# EasyEDA Pro project ORCA_Power Bus.epro

# Schematic ORCA

## Sheets
1 ORCA Power Circuit: Board Name: ORCA; Create Date: 2025-01-24; Page Name: ORCA Power Circuit; Project Name: ORCA_Pro; Schematic Name: ORCA; Update Date: 2025-01-24; Add into BOM: yes; Company: Synerbotics; Convert to PCB: yes; Date: 2025-01-23; Draw By: Nainaiu Rakhaine; REV: 1.0; Sheet: 1/1
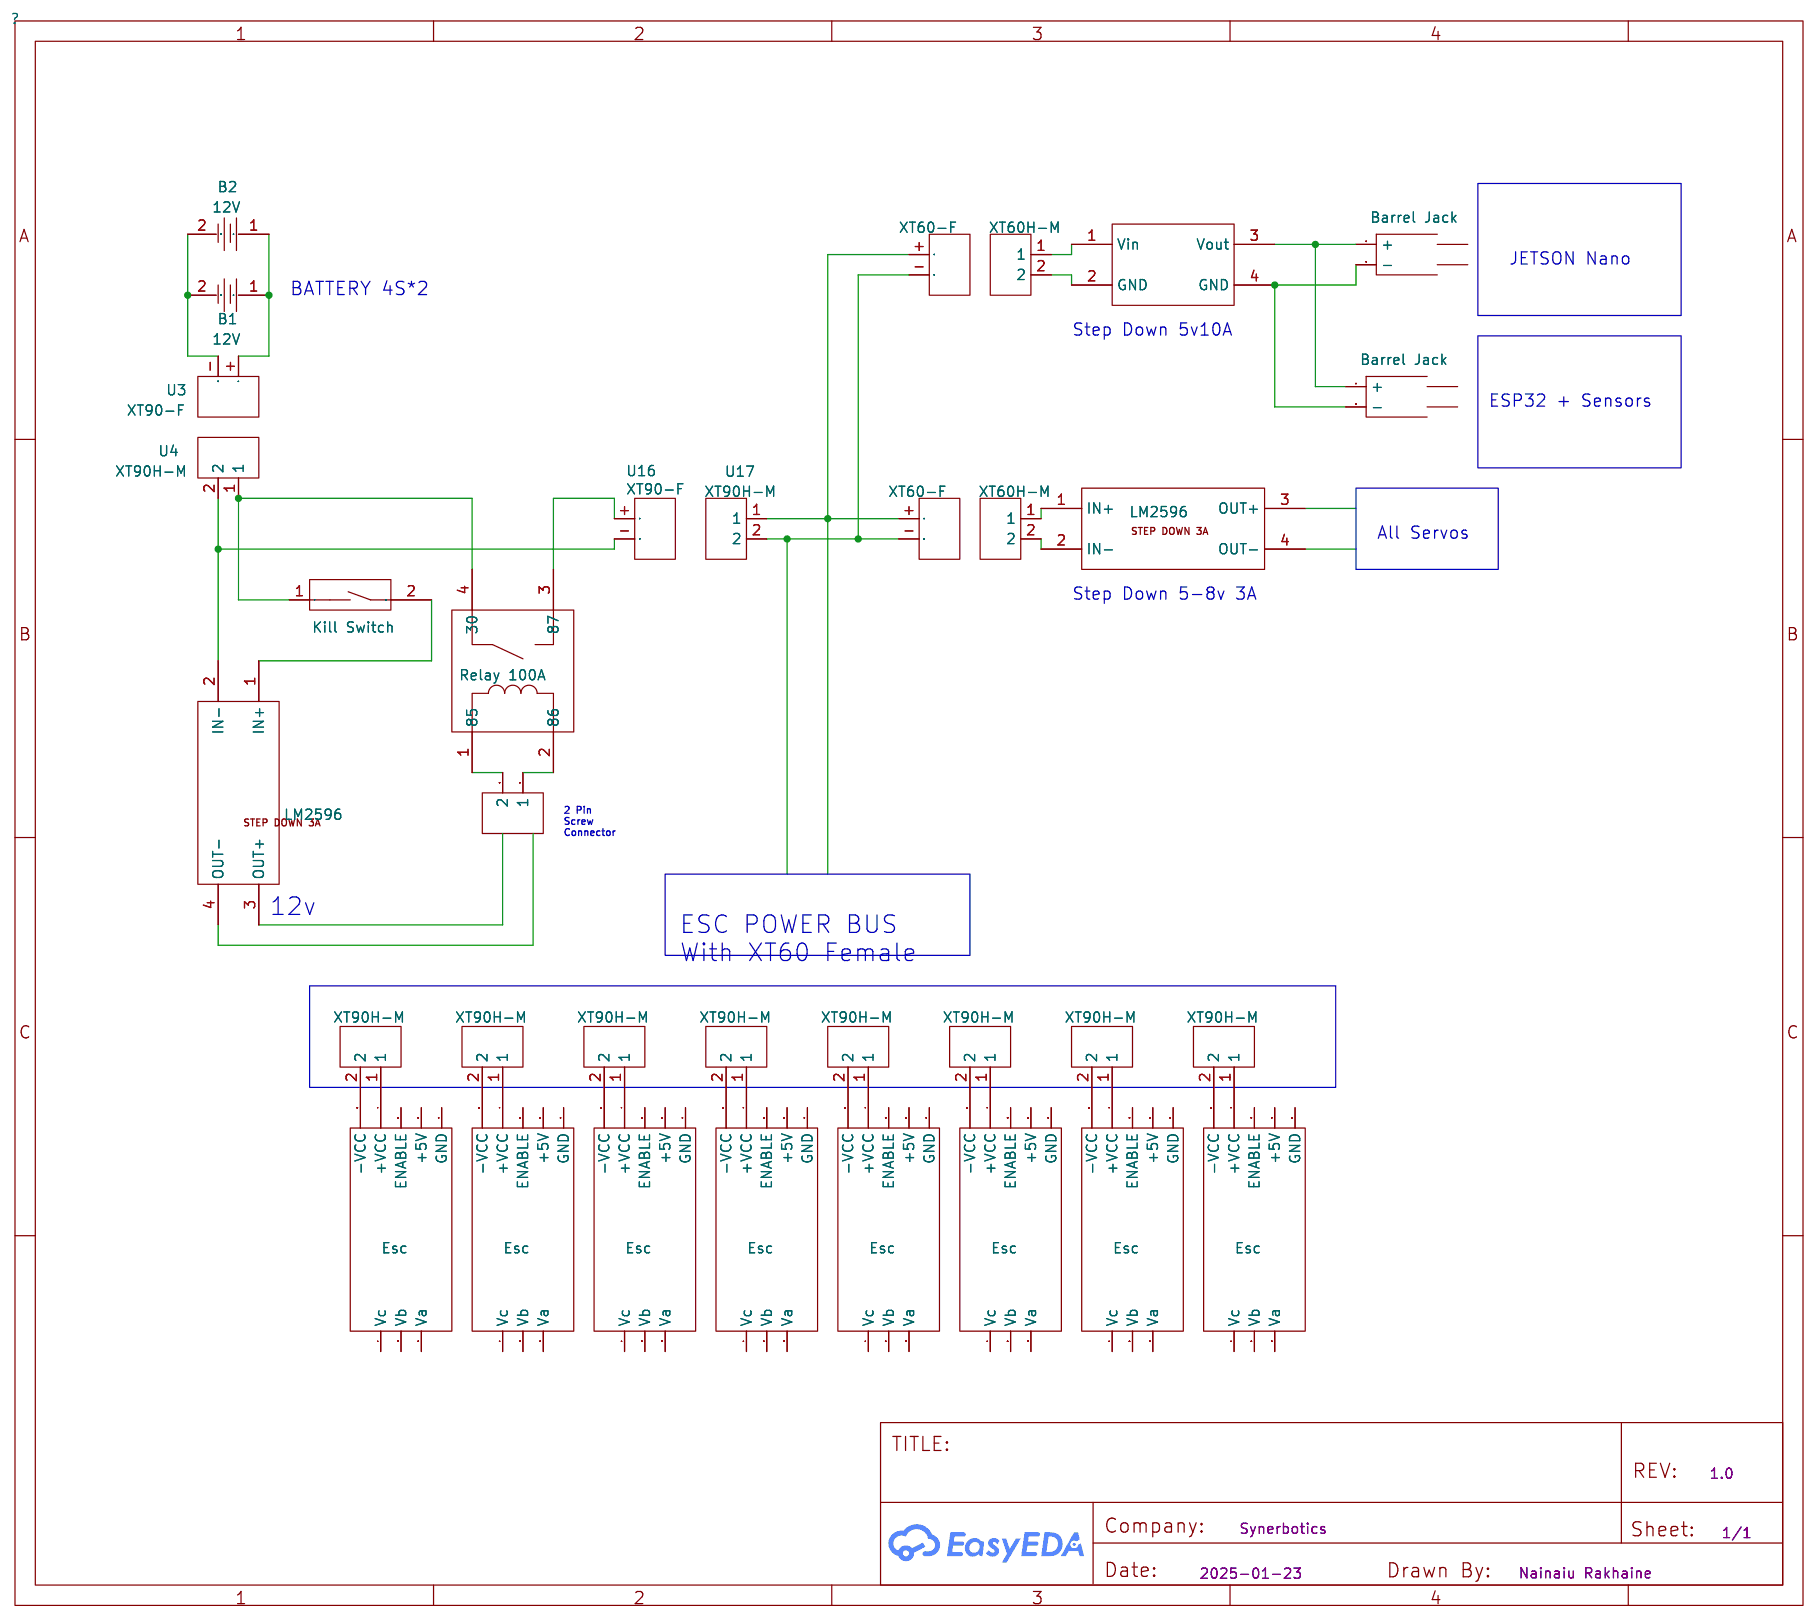
[diagram p0: ORCA Power Circuit]
2 Sheet_1
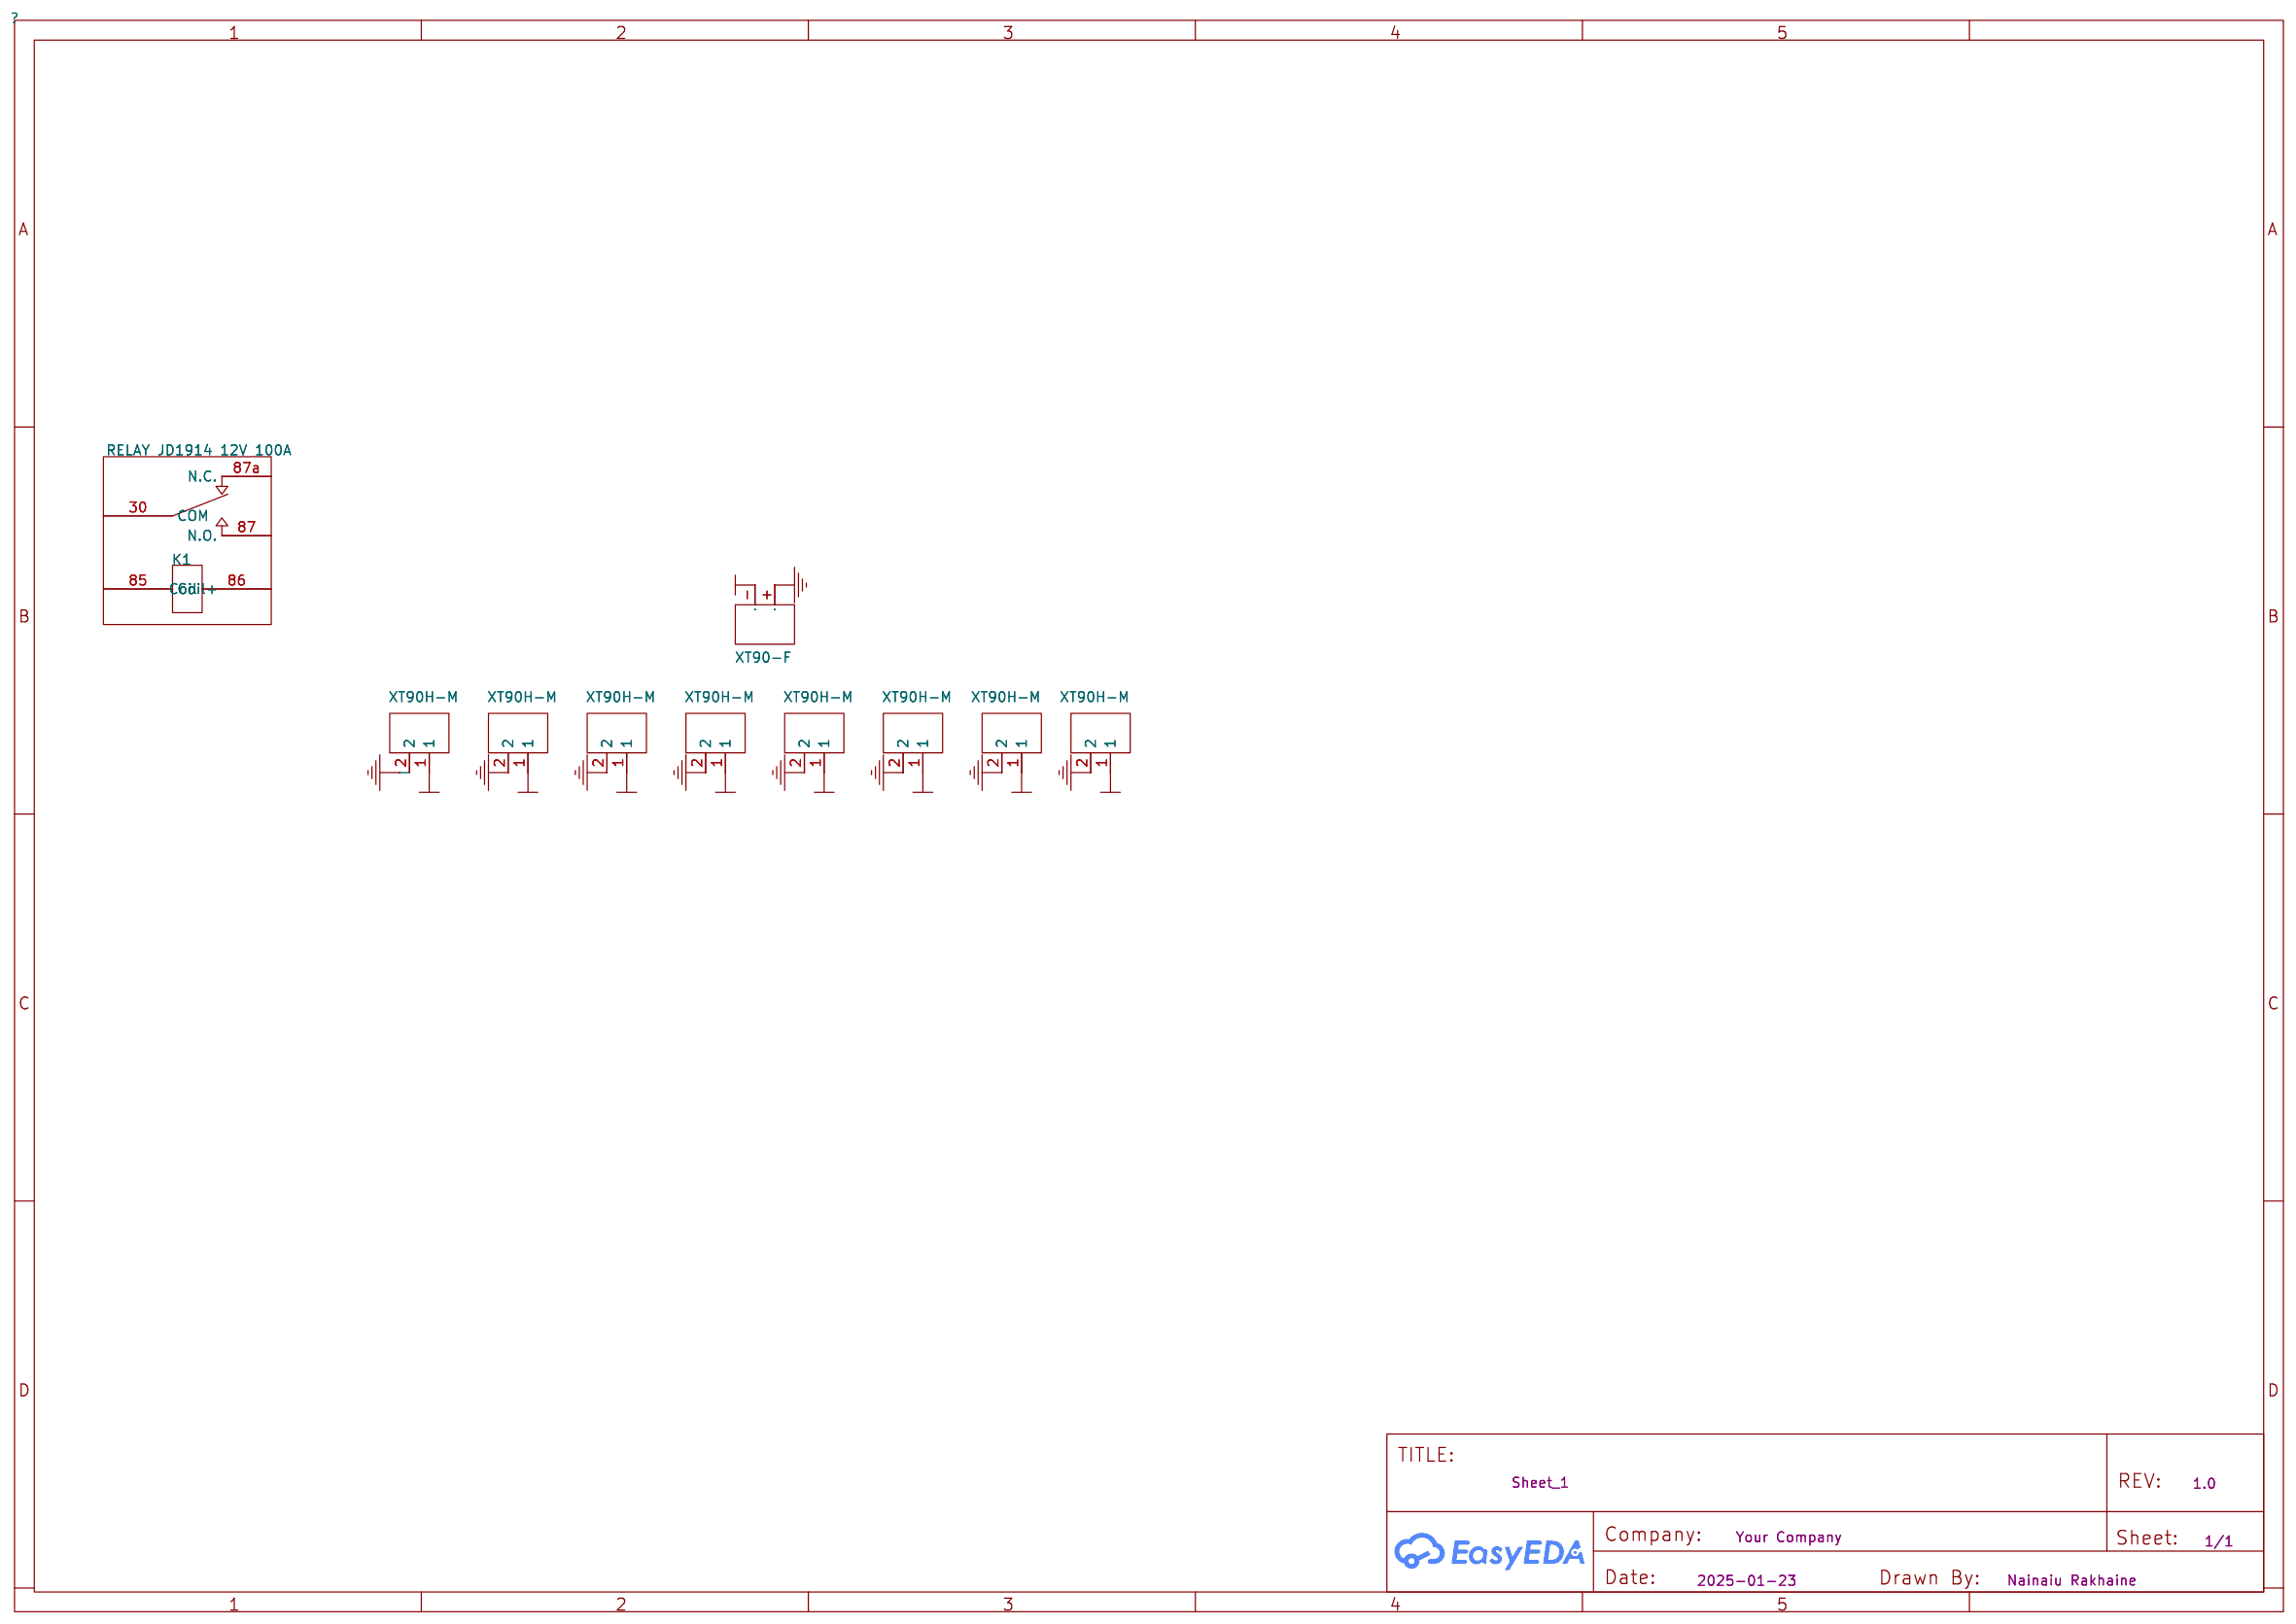
[diagram p1: Sheet_1]

## Parts
sheet ORCA Power Circuit
2  2 PIN TERMINAL BLOCK 5.08 MM
B1  12V
B2  12V
DIP1  Kill Switch
U1  Esc
U2  Relay 100A
U3  XT90-F
U4  XT90H-M
U5  XT60-F
U6  Step Down10A
U7  LM2596
U8  Barrel Jack
U9  Esc
U10  Esc
U11  Esc
U12  Esc
U13  Esc
U14  Esc
U15  Esc
U16  XT90-F
U17  XT90H-M
U18  XT90H-M
U19  XT90H-M
U20  XT90H-M
U21  XT90H-M
U22  XT90H-M
U23  XT90H-M
U24  XT90H-M
U25  XT90H-M
U26  XT60-F
U27  XT60H-M
U28  XT60H-M
U29  LM2596
U30  Barrel Jack
sheet Sheet_1
K1  RELAY JD1914 12V 100A  [JD1914]
U31  XT90-F
U32  XT90H-M
U33  XT90H-M
U34  XT90H-M
U35  XT90H-M
U36  XT90H-M
U37  XT90H-M
U38  XT90H-M
U39  XT90H-M

## Library data of the parts
2 = 2 PIN TERMINAL BLOCK 5.08 MM: Supplier: Master; Manufacturer: Unknown; Manufacturer Part: Screw Terminal Block: 2-Pin; image: https://ae01.alicdn.com/kf/HTB1jBRhXnHuK1RkSndVq6xVwpXae.jpg; Supplier Part: Unknown
B1 B2 = 12V: Supplier: LCSC; Manufacturer: Q&J; Manufacturer Part: BS-2-1; image: http://image.lceda.cn/szlcsc/C70376.jpg; Supplier Part: C70376
DIP1 = Kill Switch: Manufacturer: DIP; Manufacturer Part: DIP switchEI-08; Supplier Part: C90019; libConvert: Yes
U1 U9-U15 = Esc: Supplier: LCSC; Supplier Part: C920582; Manufacturer: PowerGood; Manufacturer Part: ESCS024W150-S-P-F50EC; JLCPCB Part Class: Extended Part
U2 = Relay 100A: Supplier: LCSC; Supplier Part: C9900017464; Manufacturer: null; Manufacturer Part: JD2912-1H-12VDC; JLCPCB Part Class: Extended Part
U3 U16 U31 = XT90-F: Supplier: LCSC; Supplier Part: C98734; Manufacturer: AMASS(艾迈斯); Manufacturer Part: XT60-F; JLCPCB Part Class: Extended Part
U4 U17-U25 U32-U39 = XT90H-M: Supplier: LCSC; Supplier Part: C5334533; Manufacturer: AMASS(艾迈斯); Manufacturer Part: XT60H-M; JLCPCB Part Class: Extended Part
U5 U26 = XT60-F: Supplier: LCSC; Supplier Part: C98734; Manufacturer: AMASS(艾迈斯); JLCPCB Part Class: Extended Part
U6 = Step Down10A
U7 U29 = LM2596: Manufacturer: PEJ; Manufacturer Part: STEP DOWN 3A; Supplier: PEJ
U8 U30 = Barrel Jack
U27 U28 = XT60H-M: Supplier: LCSC; Supplier Part: C5334533; Manufacturer: AMASS(艾迈斯); JLCPCB Part Class: Extended Part
K1 = RELAY JD1914 12V 100A: Manufacturer: BenFeng; Supplier: Aliexpress; link: http://www.msrelay.com/Auto_Relay/118.html

## Nets
GND: U31.+(1) U32.2 U33.2 U34.2 U35.2 U36.2 U37.2 U38.2 U39.2
VCC: U31.-(2) U32.1 U33.1 U34.1 U35.1 U36.1 U37.1 U38.1 U39.1
Net-(2-1): 2.1 U2.2(86)
Net-(2-2): 2.2 U2.1(85)
Net-(B1-1): B1.1 B2.1 U3.+(1)
Net-(B1-2): B1.2 B2.2 U3.-(2)
Net-(DIP1-1): DIP1.1 U2.4(30) U4.1
Net-(DIP1-2): DIP1.2 U7.1(IN+)
Net-(U1-7): U1.7(+VCC) U18.1
Net-(U1-8): U1.8(-VCC) U18.2
Net-(U2-3): U2.3(87) U16.+(1)
Net-(U4-2): U4.2 U7.2(IN-) U16.-(2)
Net-(U5-+): U5.+(1) U17.1 U26.+(1)
Net-(U5--): U5.-(2) U17.2 U26.-(2)
Net-(U6-1): U6.1(Vin) U27.1
Net-(U6-2): U6.2(GND) U27.2
Net-(U6-3): U6.3(Vout) U8.1(+) U30.1(+)
Net-(U6-4): U6.4(GND) U8.2(-) U30.2(-)
Net-(U9-7): U9.7(+VCC) U19.1
Net-(U9-8): U9.8(-VCC) U19.2
Net-(U10-7): U10.7(+VCC) U20.1
Net-(U10-8): U10.8(-VCC) U20.2
Net-(U11-7): U11.7(+VCC) U23.1
Net-(U11-8): U11.8(-VCC) U23.2
Net-(U12-7): U12.7(+VCC) U22.1
Net-(U12-8): U12.8(-VCC) U22.2
Net-(U13-7): U13.7(+VCC) U21.1
Net-(U13-8): U13.8(-VCC) U21.2
Net-(U14-7): U14.7(+VCC) U25.1
Net-(U14-8): U14.8(-VCC) U25.2
Net-(U15-7): U15.7(+VCC) U24.1
Net-(U15-8): U15.8(-VCC) U24.2
Net-(U28-1): U28.1 U29.1(IN+)
Net-(U28-2): U28.2 U29.2(IN-)

Not connected (* = marked no-connect by the designer): K1 30(COM) 85(Coil+) 86(Coil) 87(N.O.) 87a(N.C.); U1 1(GND) 2(+5V) 3(ENABLE) 4(Vc) 5(Vb) 6(Va); U7 3(OUT+) 4(OUT-); U9 1(GND) 2(+5V) 3(ENABLE) 4(Vc) 5(Vb) 6(Va); U10 1(GND) 2(+5V) 3(ENABLE) 4(Vc) 5(Vb) 6(Va); U11 1(GND) 2(+5V) 3(ENABLE) 4(Vc) 5(Vb) 6(Va); U12 1(GND) 2(+5V) 3(ENABLE) 4(Vc) 5(Vb) 6(Va); U13 1(GND) 2(+5V) 3(ENABLE) 4(Vc) 5(Vb) 6(Va); U14 1(GND) 2(+5V) 3(ENABLE) 4(Vc) 5(Vb) 6(Va); U15 1(GND) 2(+5V) 3(ENABLE) 4(Vc) 5(Vb) 6(Va); U29 3(OUT+) 4(OUT-)

## Notes on the sheets
sheet 1
- JETSON Nano
- BATTERY 4S*2
- Step Down 5v10A
- ESP32 + Sensors
- All Servos
- Step Down 5-8v 3A
- 2 Pin
  Screw
  Connector
- 12v
- ESC POWER BUS
  With XT60 Female

# Board ESC Power BUS
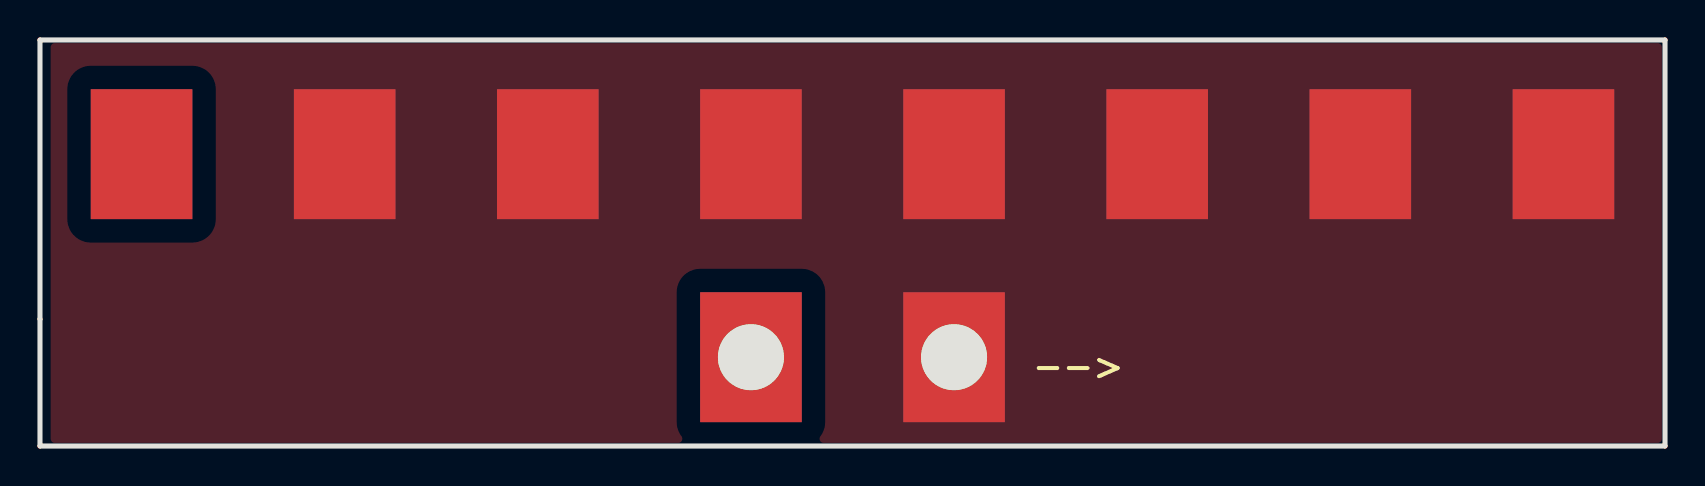
[diagram p2: board, top side]
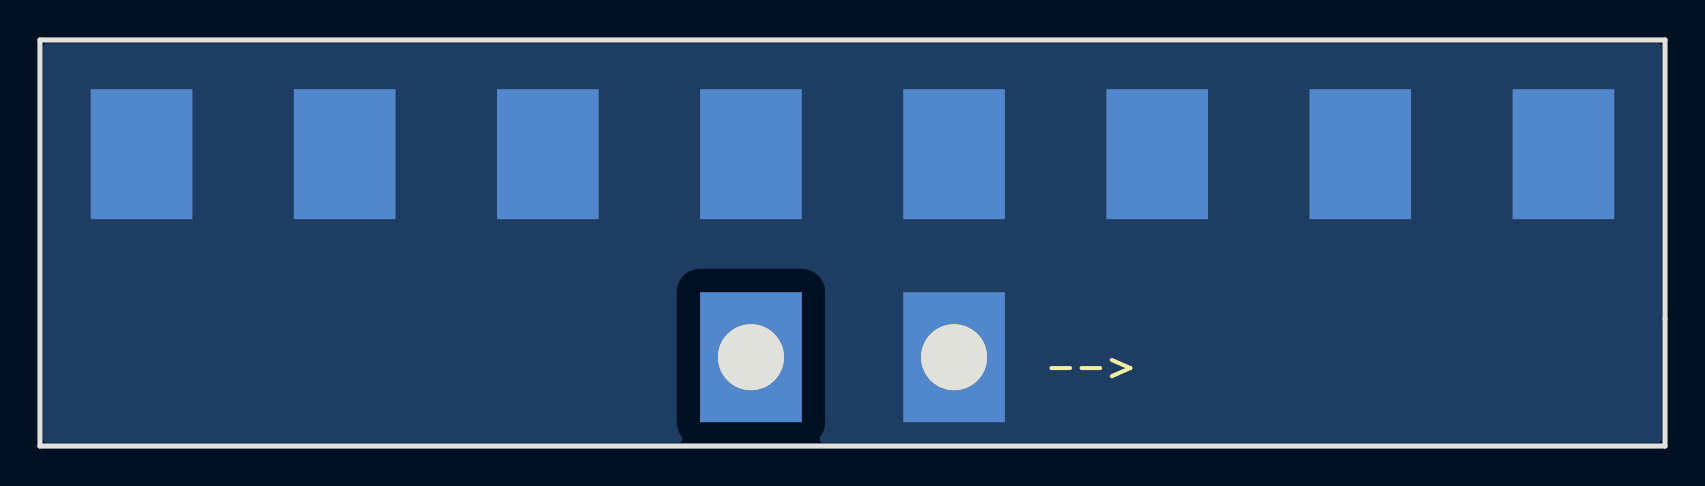
[diagram p3: board, bottom side, seen from below]

Outline 81.28 x 20.32 mm; copper layers: Top Layer, Bottom Layer. Coordinates in mm from the lower left corner of the outline.
Outline path: 0,20.32 81.28,20.32 81.28,0 0,0 0,20.32

## Design rules (mm)
spacing Default (default): track to track 0.152, other pairs 0 to 0.152
track width Default (default): min 0.254, default 0.254, max 25.4
via Default (default): diameter min 0.61, default 0.61, max 100.025; hole min 0.305, default 0.305, max 59.995
pour e14 uses gge1079
pour e24 uses gge1091

## Placement (name value [footprint] x y rotation side)
NOREF  -  [Pad_e16]  76.2 14.6 180 top
NOREF#2  -  [Pad_e18]  55.88 14.6 180 top
NOREF#3  -  [Pad_e23]  5.08 14.6 180 top
NOREF#4  -  [Pad_e10]  66.04 14.6 180 top
NOREF#5  -  [Pad_e6]  5.08 14.6 180 top
NOREF#6  -  [Pad_e22]  15.24 14.6 180 top
NOREF#7  -  [Pad_e8]  25.4 14.6 180 top
NOREF#8  -  [Pad_e13]  35.56 14.6 180 top
NOREF#9  -  [Pad_e17]  66.04 14.6 180 top
NOREF#10  -  [Pad_e20]  35.56 14.6 180 top
NOREF#11  -  [Pad_e9]  76.2 14.6 180 top
NOREF#12  -  [Pad_e7]  15.24 14.6 180 top
NOREF#13  -  [Pad_e19]  45.72 14.6 180 top
NOREF#14  -  [Pad_e29]  45.72 4.44 180 top
NOREF#15  -  [Pad_e11]  55.88 14.6 180 top
NOREF#16  -  [Pad_e28]  35.56 4.44 180 top
NOREF#17  -  [Pad_e21]  25.4 14.6 180 top
NOREF#18  -  [Pad_e12]  45.72 14.6 180 top

## Footprints (pads in the part's own frame, mm; a bottom-side part is the same pattern mirrored in y, then rotated)
Pad_e6
  rect 5.08x6.5 smd: 1(0,0)
Pad_e7
  rect 5.08x6.5 smd: 1(0,0)
Pad_e8
  rect 5.08x6.5 smd: 1(0,0)
Pad_e9
  rect 5.08x6.5 smd: 1(0,0)
Pad_e10
  rect 5.08x6.5 smd: 1(0,0)
Pad_e11
  rect 5.08x6.5 smd: 1(0,0)
Pad_e12
  rect 5.08x6.5 smd: 1(0,0)
Pad_e13
  rect 5.08x6.5 smd: 1(0,0)
Pad_e16
  rect 5.08x6.5 smd far side: 1(0,0)
Pad_e17
  rect 5.08x6.5 smd far side: 1(0,0)
Pad_e18
  rect 5.08x6.5 smd far side: 1(0,0)
Pad_e19
  rect 5.08x6.5 smd far side: 1(0,0)
Pad_e20
  rect 5.08x6.5 smd far side: 1(0,0)
Pad_e21
  rect 5.08x6.5 smd far side: 1(0,0)
Pad_e22
  rect 5.08x6.5 smd far side: 1(0,0)
Pad_e23
  rect 5.08x6.5 smd far side: 1(0,0)
Pad_e28
  rect 5.08x6.5 hole 3.302: 1(0,0)
Pad_e29
  rect 5.08x6.5 hole 3.302: 1(0,0)

## Nets
GND: NOREF.1 NOREF#2.1 NOREF#3.1 NOREF#5.1 NOREF#6.1 NOREF#9.1 NOREF#10.1 NOREF#13.1 NOREF#16.1 NOREF#17.1
V+: NOREF#4.1 NOREF#7.1 NOREF#8.1 NOREF#11.1 NOREF#12.1 NOREF#14.1 NOREF#15.1 NOREF#18.1

## Copper pours and planes (outline as drawn; the poured copper is in the pictures)
GND on Bottom Layer: -0.64,20.95 82.55,20.95 82.55,-1.27 -0.64,-1.27
V+ on Top Layer: 0.63,20.32 81.92,20.32 81.92,0 0.63,0

## Text on the board
Bottom Silkscreen Layer: -->
Top Silkscreen Layer: -->

# Board Power Circuit
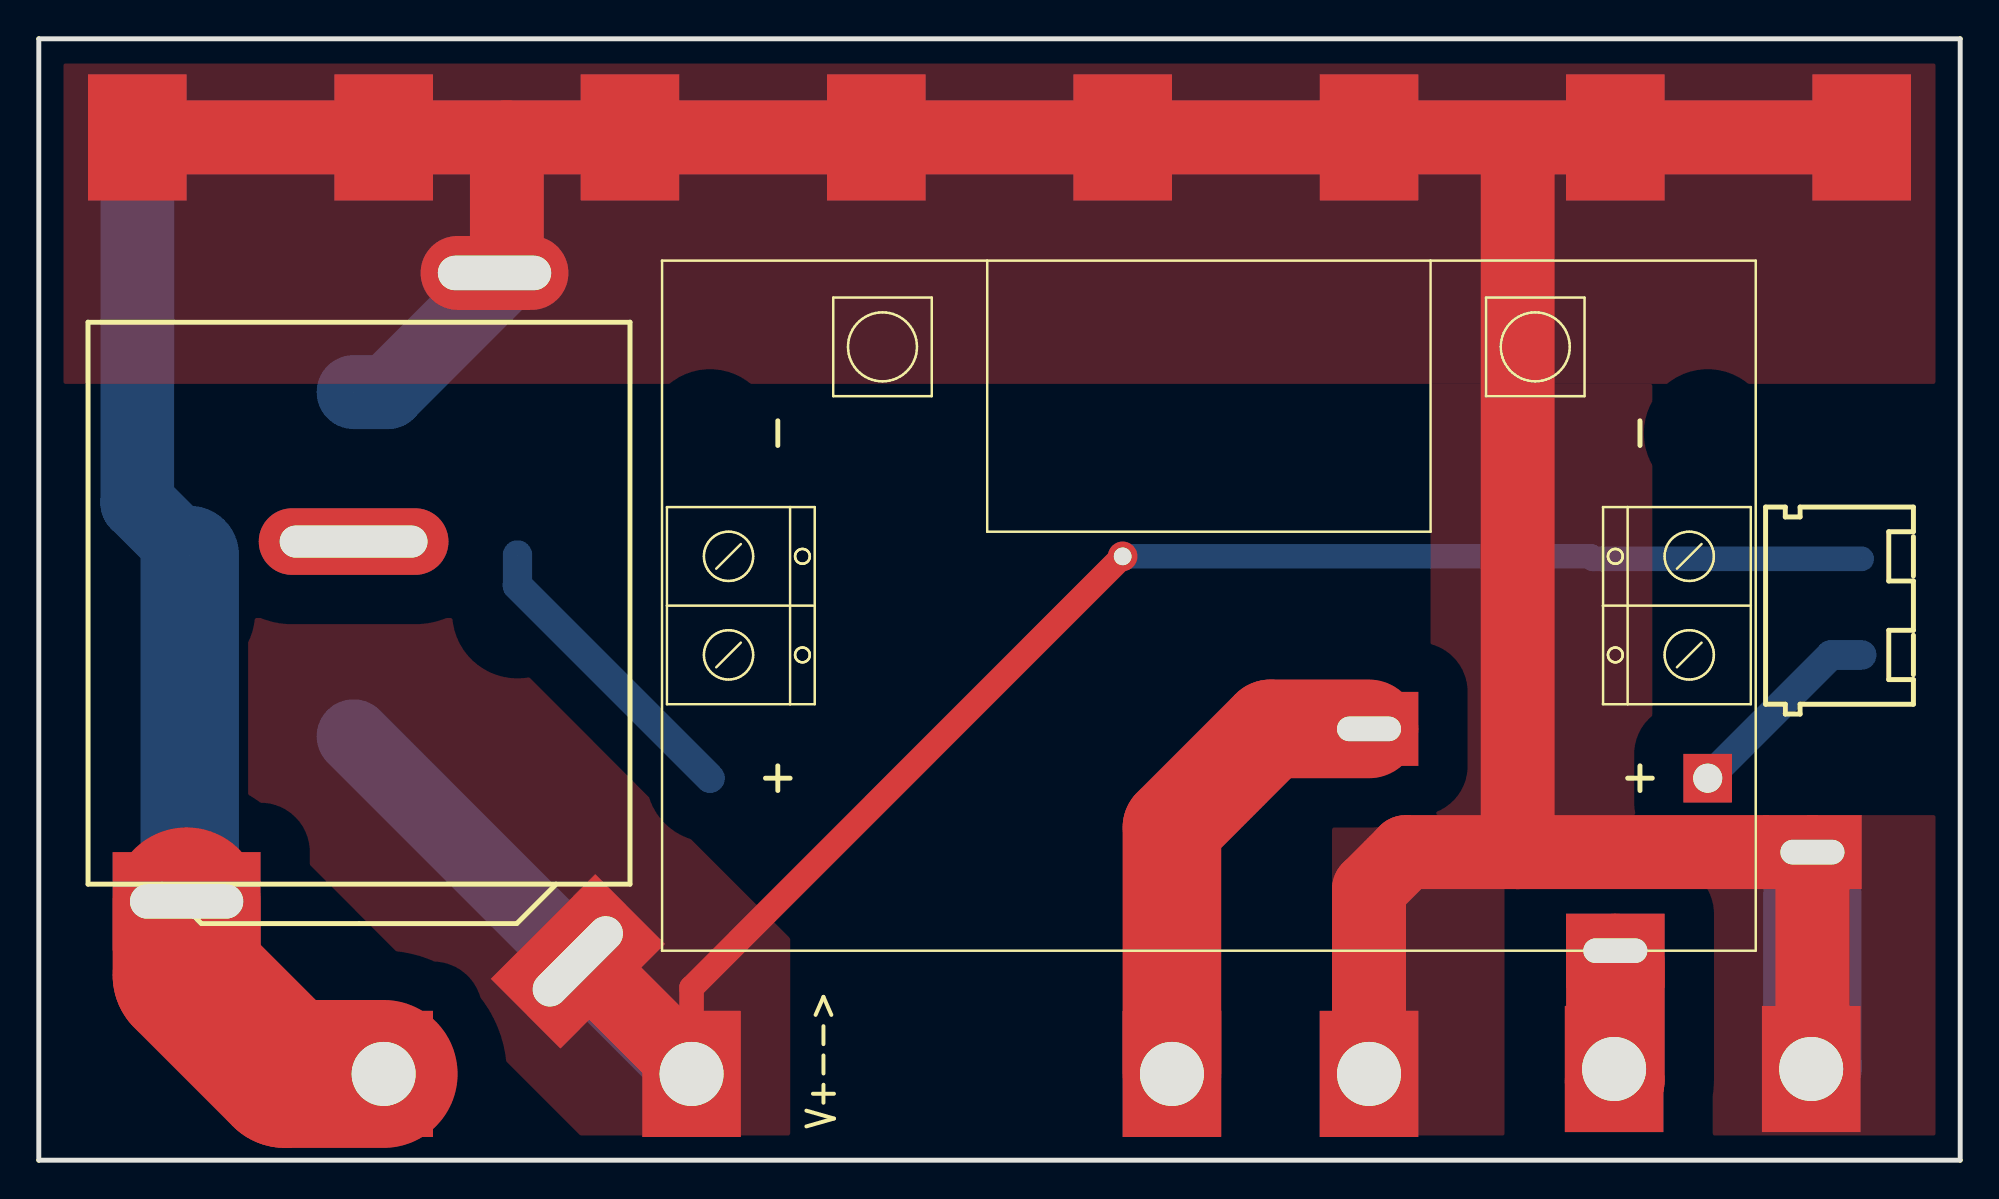
[diagram p4: board, top side]
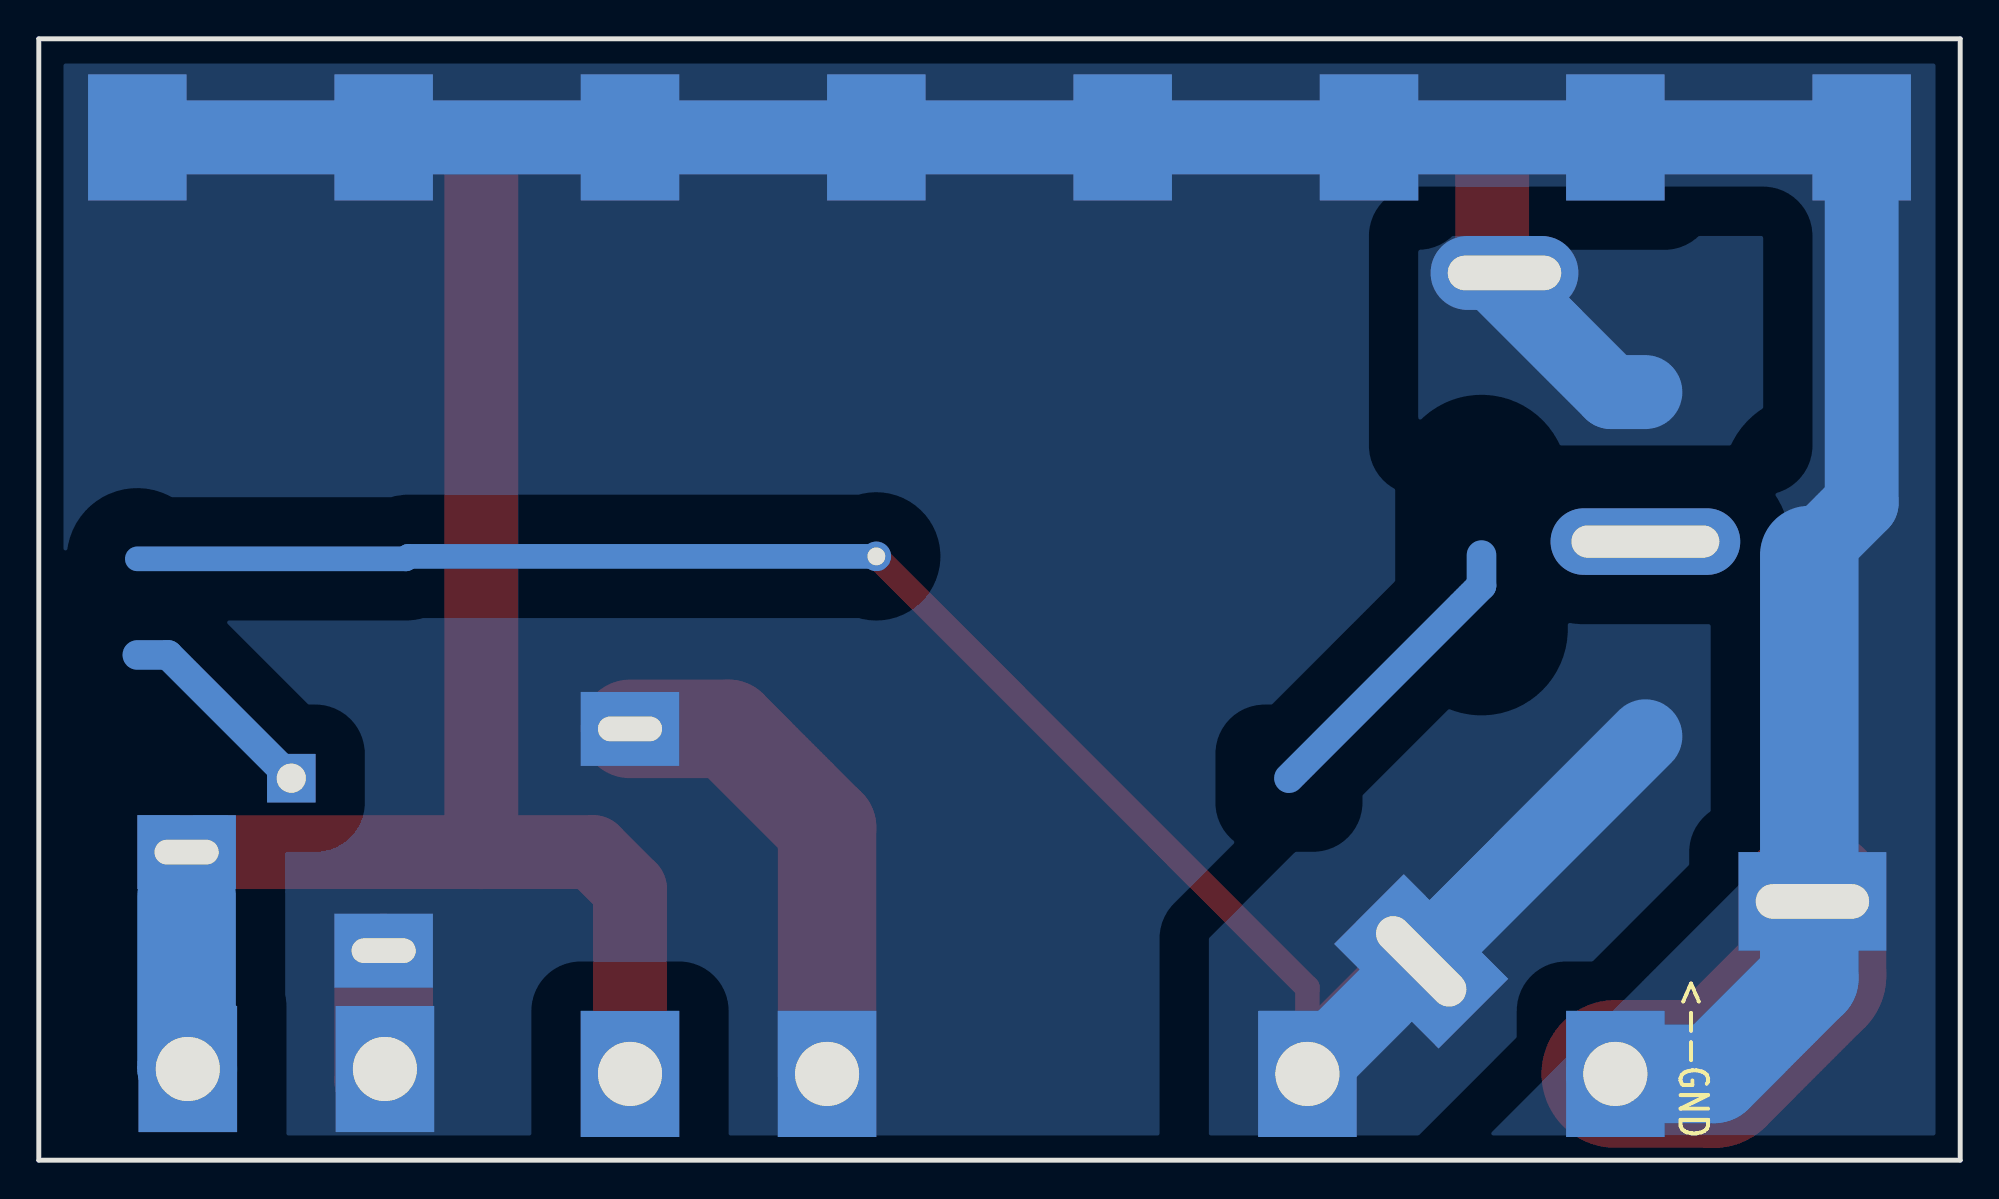
[diagram p5: board, bottom side, seen from below]

Outline 99.06 x 57.79 mm; copper layers: Top Layer, Bottom Layer. Coordinates in mm from the lower left corner of the outline.
Outline path: 0,57.79 99.06,57.79 99.06,0 0,0 0,57.79
Stack: Top Layer 0.035mm / Dielectric1 1.51mm FR4 er 4.5 / Bottom Layer 0.035mm

## Design rules (mm)
template: User Custom Config
spacing Default (default): track to track 0.152, other pairs 0 to 0.152
track width Default (default): min 0.254, default 0.254, max 25.4
differential pair differentialPair (default): width min 0.127, default 0.254, max 2.54; gap min 0.152, default 0.152
via Default (default): diameter min 0.61, default 0.61, max 100.025; hole min 0.305, default 0.305, max 59.995
pour e643 uses Default
pour e660 uses Default
pour e728 uses Default
pour e730 uses Default
pour e733 uses Default

## Placement (name value [footprint] x y rotation side)
1  -  [DC-DC-LM2596-DISP]  60.32 28.58 180 top
NOREF  -  [Pad_e12]  17.78 52.71 180 top
NOREF#2  -  [Pad_e639]  81.28 10.8 270 top
NOREF#3  -  [Pad_e26]  55.88 52.71 180 top
NOREF#4  -  [Pad_e22]  5.08 52.71 180 top
NOREF#5  -  [Pad_e10]  93.98 52.71 180 top
NOREF#6  -  [Pad_e24]  30.48 52.71 180 top
NOREF#7  -  [Pad_e9]  81.28 52.71 180 top
NOREF#8  -  [Pad_e28]  81.28 52.71 180 top
NOREF#9  -  [Pad_e23]  17.78 52.71 180 top
NOREF#10  -  [Pad_e6]  43.18 52.71 180 top
NOREF#11  -  [Pad_e494]  27.79 10.25 315 top
NOREF#12  -  [Pad_e84]  33.66 4.45 180 top
NOREF#13  -  [Pad_e168]  81.22 4.7 180 top
NOREF#14  -  [Pad_e384]  23.5 45.72 90 top
NOREF#15  -  [Pad_e629]  91.44 15.88 270 top
NOREF#16  -  [Pad_e479]  7.62 13.34 270 top
NOREF#17  -  [Pad_e29]  93.98 52.71 180 top
NOREF#18  -  [Pad_e8]  68.58 52.71 180 top
NOREF#19  -  [Pad_e7]  55.88 52.71 180 top
NOREF#20  -  [Pad_e13]  5.08 52.71 180 top
NOREF#21  -  [Pad_e541]  68.58 22.23 270 top
NOREF#22  -  [Pad_e415]  68.58 4.45 180 top
NOREF#23  -  [Pad_e414]  58.42 4.45 180 top
NOREF#24  -  [Pad_e27]  68.58 52.71 180 top
NOREF#25  -  [Pad_e85]  17.78 4.45 180 top
NOREF#26  -  [Pad_e11]  30.48 52.71 180 top
NOREF#27  -  [Pad_e169]  91.38 4.7 180 top
NOREF#28  -  [Pad_e25]  43.18 52.71 180 top
NOREF#29  -  [Pad_e341]  55.88 31.12 0 top
U1  -  [JD1914]  30.48 43.18 180 top
U2  -  [2PINCONNECTOR]  93.98 28.58 270 top

## Footprints (pads in the part's own frame, mm; a bottom-side part is the same pattern mirrored in y, then rotated)
2PINCONNECTOR
  round 0.003 hole 1.1: 1(-2.413,0) 2(2.54,0)
DC-DC-LM2596-DISP
  rect 2.5x2.5 hole 1.5x1.5: IN+(-25.718,8.89)
  rect 0.003x0.003 hole 1.5x1.5: IN-(-25.718,-8.89) OUT+(25.718,8.89) OUT-(25.718,-8.89)
JD1914
  oval 0.003x0.003 hole 1.651x7.62: 30(14.249,21.336) 85(22.7,11.999) 86(5.8,11.999)
  oval 0.003x0.003 hole 7.62x1.651: 87(14.249,3.6)
  oval 9.779x3.429 hole 7.62x1.651: 87a(14.249,11.303)
Pad_e6
  rect 5.08x6.5 smd: 1(0,0)
Pad_e7
  rect 5.08x6.5 smd: 1(0,0)
Pad_e8
  rect 5.08x6.5 smd: 1(0,0)
Pad_e9
  rect 5.08x6.5 smd: 1(0,0)
Pad_e10
  rect 5.08x6.5 smd: 1(0,0)
Pad_e11
  rect 5.08x6.5 smd: 1(0,0)
Pad_e12
  rect 5.08x6.5 smd: 1(0,0)
Pad_e13
  rect 5.08x6.5 smd: 1(0,0)
Pad_e22
  rect 5.08x6.5 smd far side: 1(0,0)
Pad_e23
  rect 5.08x6.5 smd far side: 1(0,0)
Pad_e24
  rect 5.08x6.5 smd far side: 1(0,0)
Pad_e25
  rect 5.08x6.5 smd far side: 1(0,0)
Pad_e26
  rect 5.08x6.5 smd far side: 1(0,0)
Pad_e27
  rect 5.08x6.5 smd far side: 1(0,0)
Pad_e28
  rect 5.08x6.5 smd far side: 1(0,0)
Pad_e29
  rect 5.08x6.5 smd far side: 1(0,0)
Pad_e84
  rect 5.08x6.5 hole 3.302: 1(0,0)
Pad_e85
  rect 5.08x6.5 hole 3.302: 1(0,0)
Pad_e168
  rect 5.08x6.5 hole 3.302: 1(0,0)
Pad_e169
  rect 5.08x6.5 hole 3.302: 1(0,0)
Pad_e341
  round 1.524 hole 0.914: 1(0,0)
Pad_e384
  oval 3.81x7.62 hole 1.778x5.842: 1(0,0)
Pad_e414
  rect 5.08x6.5 hole 3.302: 1(0,0)
Pad_e415
  rect 5.08x6.5 hole 3.302: 1(0,0)
Pad_e479
  rect 5.08x7.62 hole 1.778x5.842: 1(0,0)
Pad_e494
  rect 5.08x7.62 hole 1.778x5.842: 1(0,0)
Pad_e541
  rect 3.81x5.08 hole 1.27x3.302: 1(0,0)
Pad_e629
  rect 3.81x5.08 hole 1.27x3.302: 1(0,0)
Pad_e639
  rect 3.81x5.08 hole 1.27x3.302: 1(0,0)

## Nets
+12V: 1.OUT+ U1.86
GND: 1.IN- 1.OUT- NOREF#2.1 NOREF#3.1 NOREF#4.1 NOREF#6.1 NOREF#8.1 NOREF#9.1 NOREF#13.1 NOREF#16.1 NOREF#17.1 NOREF#21.1 NOREF#23.1 NOREF#24.1 NOREF#25.1 NOREF#28.1 U1.85
BAT+: NOREF#11.1 NOREF#12.1 NOREF#29.1 U1.30 U2.1
BAT++: 1.IN+ U2.2
V+: NOREF.1 NOREF#5.1 NOREF#7.1 NOREF#10.1 NOREF#14.1 NOREF#15.1 NOREF#18.1 NOREF#19.1 NOREF#20.1 NOREF#22.1 NOREF#26.1 NOREF#27.1 U1.87

Pads without a net: U1 87a

## Routing (per net, layer and track width the routed paths; a pad name or vN(x,y) marks a point on that pad's centre or on a via; arc(x,y) is an arc through that point)
+12V: length 15.6
  Bottom Layer w1.524: 1.OUT+ 24.68,29.61 U1.86
GND: length 192.6
  Top Layer w5.08: NOREF#23.1 58.42,17.15 63.5,22.23 NOREF#21.1 ; 81.28,10.16 81.28,4.13 81.22,4.06
  Top Layer w7.62: NOREF#25.1 12.7,4.45 7.62,9.53 NOREF#16.1
  Bottom Layer w3.81: U1.85 5.08,33.88 NOREF#4.1 NOREF#9.1 NOREF#6.1 NOREF#28.1 NOREF#3.1 NOREF#24.1 NOREF#8.1 NOREF#17.1
  Bottom Layer w5.08: NOREF#25.1 12.7,4.45 7.78,9.37 U1.85
BAT+: length 105.8
  Top Layer w1.27: 33.66,5.51 33.66,8.89 NOREF#29.1
  Top Layer w3.81: NOREF#11.1 28.06,10.25 33.22,5.08 33.66,5.51
  Bottom Layer w1.27: NOREF#29.1 80.01,31.12 80.14,30.99 U2.1
  Bottom Layer w3.81: NOREF#12.1 27.85,10.25 NOREF#11.1 27.79,10.28 U1.30
BAT++: length 10.6
  Bottom Layer w1.524: 1.IN+ 92.39,26.04 U2.2
V+: length 193.3
  Top Layer w3.81: 24.13,52.71 NOREF#26.1 NOREF#10.1 NOREF#19.1 NOREF#18.1 NOREF#7.1 NOREF#5.1 ; 24.13,52.71 24.13,45.72 ; 24.13,52.71 NOREF.1 NOREF#20.1 ; NOREF#22.1 68.58,13.97 70.49,15.88 76.25,15.88 ; NOREF#27.1 91.44,4.76 NOREF#15.1 ; 76.25,52.07 76.25,15.88 ; 76.25,15.88 88.94,15.88
  Bottom Layer w3.81: 24.13,45.72 17.99,39.58 U1.87
  Bottom Layer w5.08: NOREF#27.1 91.44,4.76 91.44,13.59

## Copper pours and planes (outline as drawn; the poured copper is in the pictures)
GND on Top Layer: 5.72,10.8 15.24,10.8 15.24,2.54 5.72,2.54
GND on Bottom Layer: 0,57.79 104.14,57.79 104.14,3.18 99.69,-1.27 0,-2.12
BAT+ on Top Layer: 27.94,9.91 33.66,9.91 33.66,4.45 27.94,4.45
BAT+ on Top Layer: 10.8,27.94 22.22,27.94 38.74,11.43 38.74,0 29.19,0 10.8,18.4
BAT+ on Bottom Layer: 10.8,27.94 22.22,27.94 38.74,11.43 38.74,0 29.19,0 10.8,18.4
V+ on Top Layer: 0,57.79 99.06,57.79 99.06,40.01 0,40.01
V+ on Top Layer: 66.68,17.78 75.56,17.78 75.56,1.27 66.68,1.27
V+ on Top Layer: 71.75,40.01 83.19,40.01 83.19,17.78 71.75,17.78
V+ on Top Layer: 85.09,17.78 98.43,17.78 98.43,0 85.09,0
V+ on Bottom Layer: 10.16,47.63 27.94,47.63 27.94,36.83 10.16,36.83
V+ on Bottom Layer: 90.17,16.51 92.71,16.51 92.71,8 90.17,8

## Text on the board
Bottom Silkscreen Layer: <--GND
Top Silkscreen Layer: V+-->
